# Altium schematic sheet grov_pcb_card.SchDoc
size 444 x 241 mm; SheetNumber: 1; SheetTotal: 1
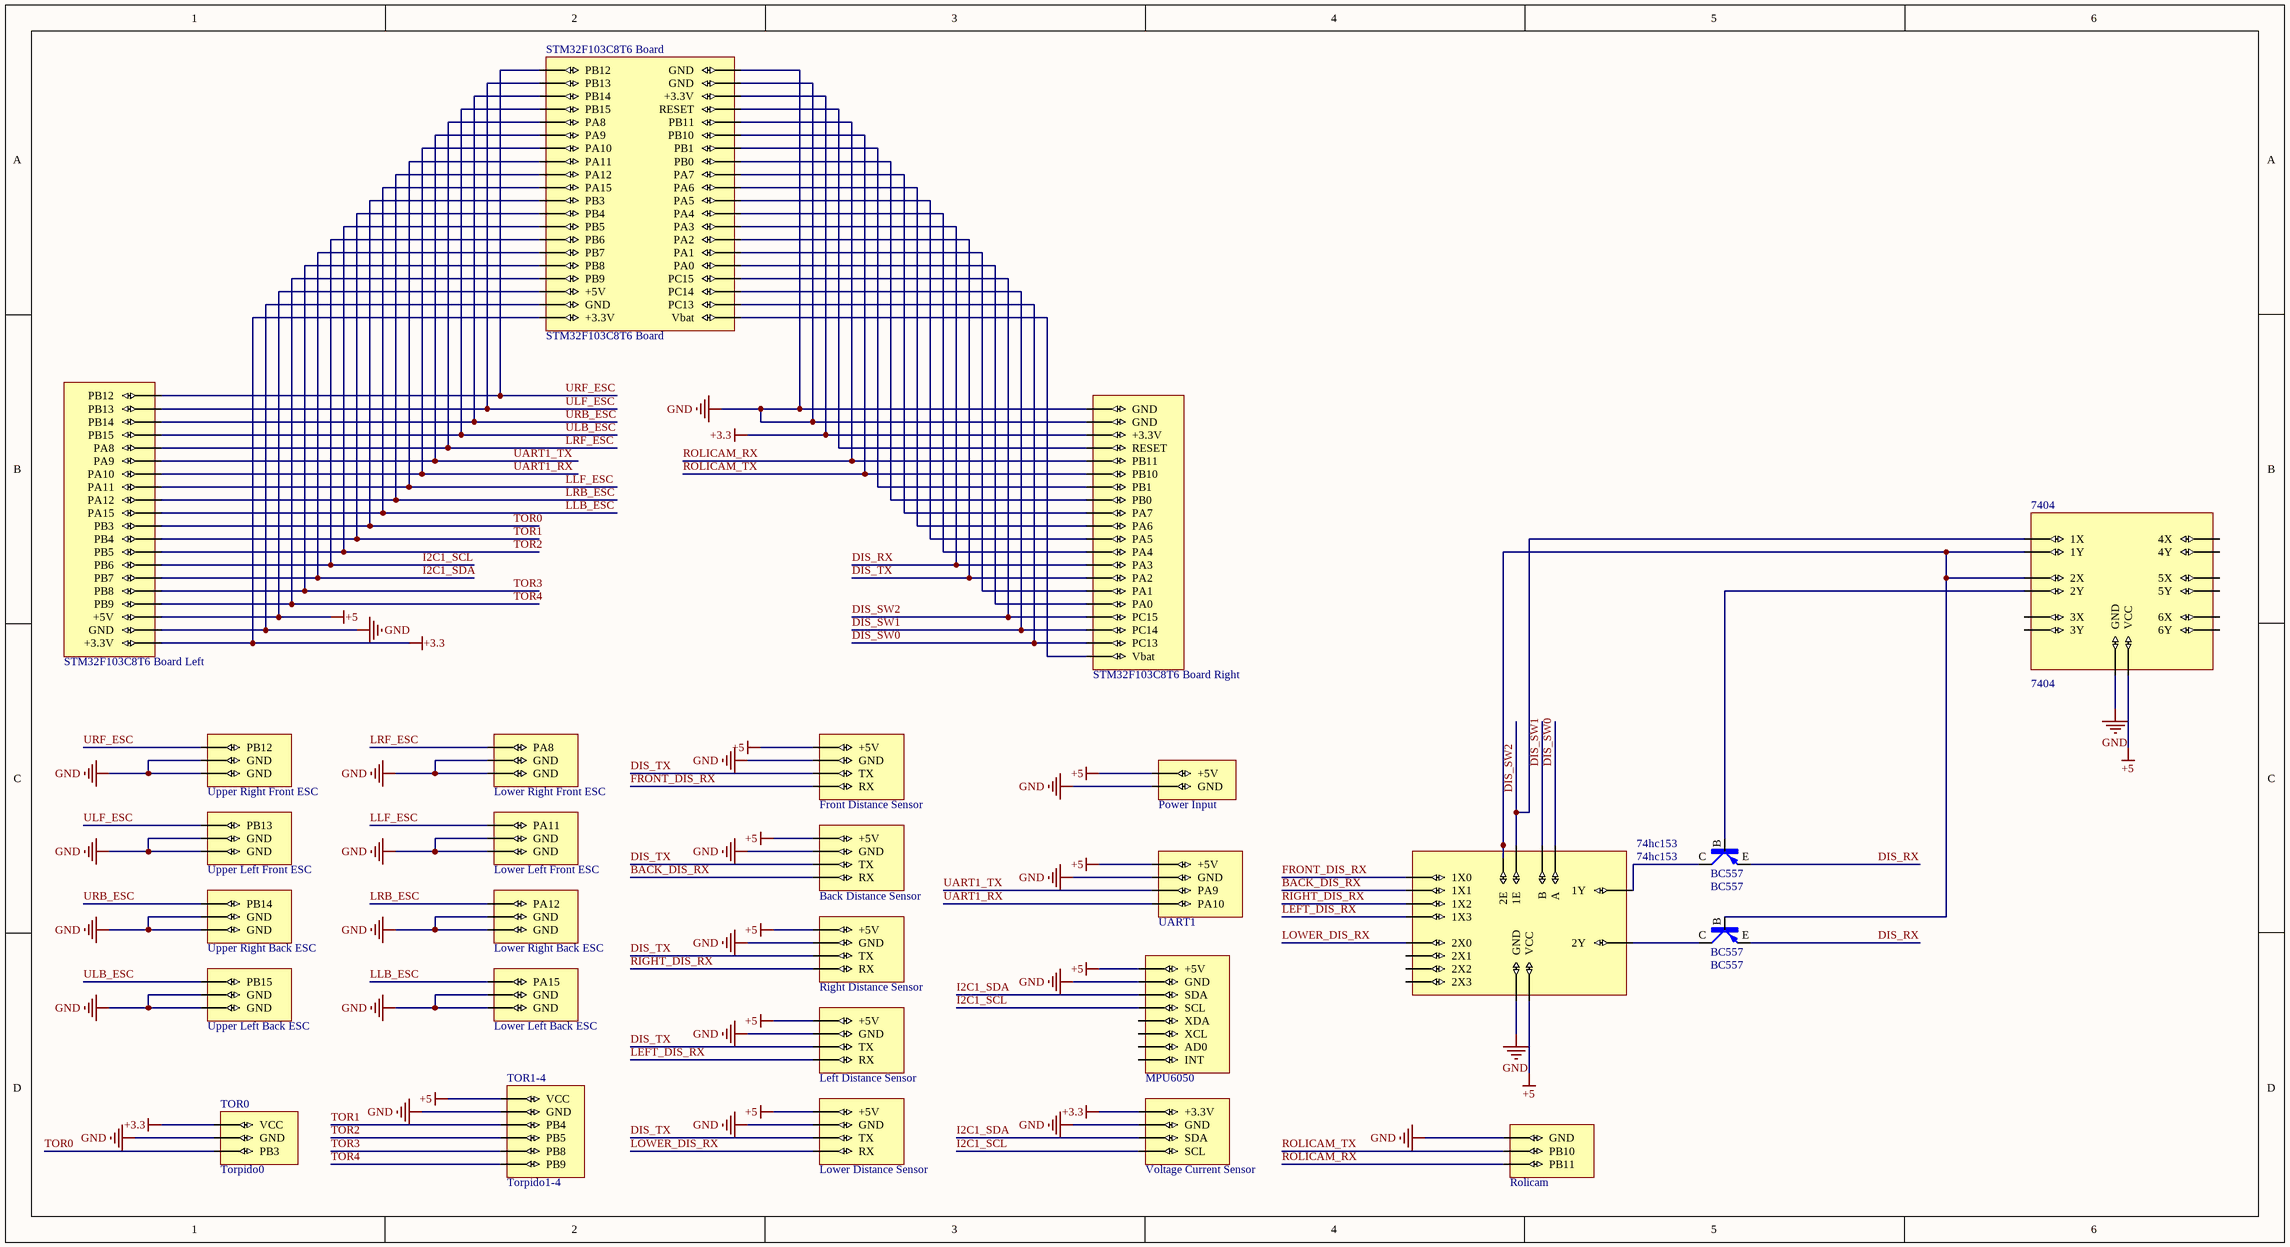
[diagram p0: grov_pcb_card.SchDoc]

## Parts
(Parts that share a designator on the sheet are numbered #1, #2 ... from top to bottom, then left to right.)
74hc153  74hc153  [74HC153]
7404  7404  [7404]
Back_Distance_Sensor  Back Distance Sensor  [Back Distance Sensor]
BC557#1  BC557  [BC557]
BC557#2  BC557  [BC557]
Front_Distance_Sensor  Front Distance Sensor  [Front Distance Sensor]
Left_Distance_Sensor  Left Distance Sensor  [Left Distance Sensor]
Lower_Distance_Sensor  Lower Distance Sensor  [Lower Distance Sensor]
Lower_Left_Back_ESC  Lower Left Back ESC  [Lower Left Back ESC]
Lower_Left_Front_ESC  Lower Left Front ESC  [Lower Left Front ESC]
Lower_Right_Back_ESC  Lower Right Back ESC  [Lower Right Back ESC]
Lower_Right_Front_ESC  Lower Right Front ESC  [Lower Right Front ESC]
MPU6050  MPU6050  [MPU6050]
Power_Input  Power Input  [Power Input]
Right_Distance_Sensor  Right Distance Sensor  [Right Distance Sensor]
Rolicam  Rolicam  [Rolicam]
STM32F103C8T6_Board#1  STM32F103C8T6 Board  [STM32F103C8T6 Board]
STM32F103C8T6_Board#2  STM32F103C8T6 Board Right  [STM32F103C8T6 Board Right]
STM32F103C8T6_Board_Left  STM32F103C8T6 Board Left  [STM32F103C8T6 Board Left]
TOR0  Torpido0  [TORPIDO0]
TOR1-4  Torpido1-4  [Torpido1-4]
UART1  UART1  [UART1]
Upper_Left_Back_ESC  Upper Left Back ESC  [Upper Left Back ESC]
Upper_Left_Front_ESC  Upper Left Front ESC  [Upper Left Front ESC]
Upper_Right_Back_ESC  Upper Right Back ESC  [Upper Right Back ESC]
Upper_Right_Front_ESC  Upper Right Front ESC  [Upper Right Front ESC]
V/C_Sensor  Voltage Current Sensor  [Voltage Current Sensor]

## Nets
+3.3: STM32F103C8T6_Board#1.+3.3V STM32F103C8T6_Board#2.+3.3V STM32F103C8T6_Board_Left.+3.3V TOR0.+3.3V(VCC) V/C_Sensor.+3.3V
+5: 74hc153.+5V(VCC) 7404.+5V(VCC) Back_Distance_Sensor.+5V Front_Distance_Sensor.+5V Left_Distance_Sensor.+5V Lower_Distance_Sensor.+5V MPU6050.+5V Power_Input.+5V Right_Distance_Sensor.+5V STM32F103C8T6_Board#1.+5V STM32F103C8T6_Board_Left.+5V TOR1-4.+5V(VCC) UART1.+5V
GND: 74hc153.GND 7404.GND Back_Distance_Sensor.GND Front_Distance_Sensor.GND Left_Distance_Sensor.GND Lower_Distance_Sensor.GND Lower_Left_Back_ESC.GND Lower_Left_Front_ESC.GND Lower_Right_Back_ESC.GND Lower_Right_Front_ESC.GND MPU6050.GND Power_Input.GND Right_Distance_Sensor.GND Rolicam.GND STM32F103C8T6_Board#1.GND STM32F103C8T6_Board#2.GND STM32F103C8T6_Board_Left.GND TOR0.GND TOR1-4.GND UART1.GND Upper_Left_Back_ESC.GND Upper_Left_Front_ESC.GND Upper_Right_Back_ESC.GND Upper_Right_Front_ESC.GND V/C_Sensor.GND
BACK_DIS_RX: 74hc153.1X1 Back_Distance_Sensor.RX
DIS_RX: BC557#1.E BC557#2.E STM32F103C8T6_Board#1.PA3 STM32F103C8T6_Board#2.PA3
DIS_SW0: 74hc153.A STM32F103C8T6_Board#1.PC13 STM32F103C8T6_Board#2.PC13
DIS_SW1: 74hc153.B STM32F103C8T6_Board#1.PC14 STM32F103C8T6_Board#2.PC14
DIS_SW2: 74hc153.1E 7404.1X STM32F103C8T6_Board#1.PC15 STM32F103C8T6_Board#2.PC15
DIS_TX: Back_Distance_Sensor.TX Front_Distance_Sensor.TX Left_Distance_Sensor.TX Lower_Distance_Sensor.TX Right_Distance_Sensor.TX STM32F103C8T6_Board#1.PA2 STM32F103C8T6_Board#2.PA2
FRONT_DIS_RX: 74hc153.1X0 Front_Distance_Sensor.RX
I2C1_SCL: MPU6050.SCL STM32F103C8T6_Board#1.PB6 STM32F103C8T6_Board_Left.PB6 V/C_Sensor.SCL
I2C1_SDA: MPU6050.SDA STM32F103C8T6_Board#1.PB7 STM32F103C8T6_Board_Left.PB7 V/C_Sensor.SDA
LEFT_DIS_RX: 74hc153.1X3 Left_Distance_Sensor.RX
LLB_ESC: Lower_Left_Back_ESC.SIG(PA15) STM32F103C8T6_Board#1.PA15 STM32F103C8T6_Board_Left.PA15
LLF_ESC: Lower_Left_Front_ESC.SIG(PA11) STM32F103C8T6_Board#1.PA11 STM32F103C8T6_Board_Left.PA11
LOWER_DIS_RX: 74hc153.2X0 Lower_Distance_Sensor.RX
LRB_ESC: Lower_Right_Back_ESC.SIG(PA12) STM32F103C8T6_Board#1.PA12 STM32F103C8T6_Board_Left.PA12
LRF_ESC: Lower_Right_Front_ESC.SIG(PA8) STM32F103C8T6_Board#1.PA8 STM32F103C8T6_Board_Left.PA8
RIGHT_DIS_RX: 74hc153.1X2 Right_Distance_Sensor.RX
ROLICAM_RX: Rolicam.RX(PB11) STM32F103C8T6_Board#1.PB11 STM32F103C8T6_Board#2.PB11
ROLICAM_TX: Rolicam.TX(PB10) STM32F103C8T6_Board#1.PB10 STM32F103C8T6_Board#2.PB10
TOR0: STM32F103C8T6_Board#1.PB3 STM32F103C8T6_Board_Left.PB3 TOR0.SIG(PB3)
TOR1: STM32F103C8T6_Board#1.PB4 STM32F103C8T6_Board_Left.PB4 TOR1-4.IN1(PB4)
TOR2: STM32F103C8T6_Board#1.PB5 STM32F103C8T6_Board_Left.PB5 TOR1-4.IN2(PB5)
TOR3: STM32F103C8T6_Board#1.PB8 STM32F103C8T6_Board_Left.PB8 TOR1-4.IN3(PB8)
TOR4: STM32F103C8T6_Board#1.PB9 STM32F103C8T6_Board_Left.PB9 TOR1-4.IN4(PB9)
UART1_RX: STM32F103C8T6_Board#1.PA10 STM32F103C8T6_Board_Left.PA10 UART1.RX(PA10)
UART1_TX: STM32F103C8T6_Board#1.PA9 STM32F103C8T6_Board_Left.PA9 UART1.TX(PA9)
ULB_ESC: STM32F103C8T6_Board#1.PB15 STM32F103C8T6_Board_Left.PB15 Upper_Left_Back_ESC.SIG(PB15)
ULF_ESC: STM32F103C8T6_Board#1.PB13 STM32F103C8T6_Board_Left.PB13 Upper_Left_Front_ESC.SIG(PB13)
URB_ESC: STM32F103C8T6_Board#1.PB14 STM32F103C8T6_Board_Left.PB14 Upper_Right_Back_ESC.SIG(PB14)
URF_ESC: STM32F103C8T6_Board#1.PB12 STM32F103C8T6_Board_Left.PB12 Upper_Right_Front_ESC.SIG(PB12)
Net74hc153_1Y: 74hc153.1Y BC557#1.C
Net74hc153_2E: 74hc153.2E 7404.1Y 7404.2X BC557#2.B
Net74hc153_2Y: 74hc153.2Y BC557#2.C
Net7404_2Y: 7404.2Y BC557#1.B
NetSTM32F103C8T6_Board#1_PA0: STM32F103C8T6_Board#1.PA0 STM32F103C8T6_Board#2.PA0
NetSTM32F103C8T6_Board#1_PA1: STM32F103C8T6_Board#1.PA1 STM32F103C8T6_Board#2.PA1
NetSTM32F103C8T6_Board#1_PA4: STM32F103C8T6_Board#1.PA4 STM32F103C8T6_Board#2.PA4
NetSTM32F103C8T6_Board#1_PA5: STM32F103C8T6_Board#1.PA5 STM32F103C8T6_Board#2.PA5
NetSTM32F103C8T6_Board#1_PA6: STM32F103C8T6_Board#1.PA6 STM32F103C8T6_Board#2.PA6
NetSTM32F103C8T6_Board#1_PA7: STM32F103C8T6_Board#1.PA7 STM32F103C8T6_Board#2.PA7
NetSTM32F103C8T6_Board#1_PB0: STM32F103C8T6_Board#1.PB0 STM32F103C8T6_Board#2.PB0
NetSTM32F103C8T6_Board#1_PB1: STM32F103C8T6_Board#1.PB1 STM32F103C8T6_Board#2.PB1
NetSTM32F103C8T6_Board#1_RESET: STM32F103C8T6_Board#1.RESET STM32F103C8T6_Board#2.RESET
NetSTM32F103C8T6_Board#1_Vbat: STM32F103C8T6_Board#1.Vbat STM32F103C8T6_Board#2.Vbat

Not connected (* = marked no-connect by the designer): 74hc153 2X1 2X2 2X3; 7404 3X 3Y 4X 4Y 5X 5Y 6X 6Y; MPU6050 AD0 INT XCL XDA

## Library data of the parts
BC557#1 BC557#2 = BC557: Bipolar (BJT) Transistor PNP 45 V 100 mA 320MHz 625 mW Through Hole TO-92 (TO-226); MF: ON; Availability: In Stock; Package: E-PKG AXIAL-LEADED-2 ON Semiconductor; MP: BC557; Value: *; Check_prices: https://www.snapeda.com/parts/BC557/Onsemi/view-part/?ref=eda; SnapEDA_Link: https://www.snapeda.com/parts/BC557/Onsemi/view-part/?ref=snap; Price: None